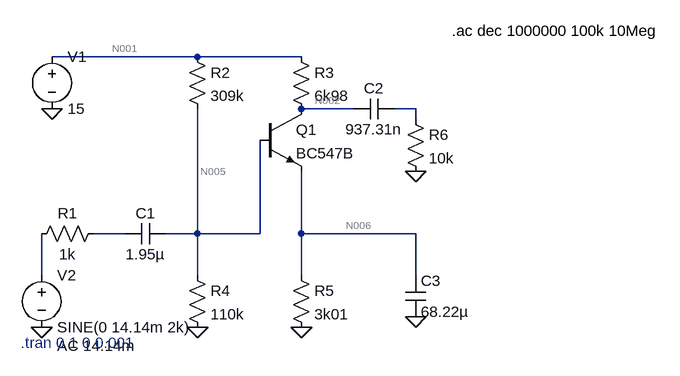
[diagram p0: schematic kursusgang 9.asc]
kursusgang 9.asc, the LTspice schematic file:
Version 4
SHEET 1 972 680
WIRE 224 96 0 96
WIRE 384 96 224 96
WIRE 464 176 384 176
WIRE 560 176 528 176
WIRE 560 192 560 176
WIRE 112 368 64 368
WIRE 224 368 224 176
WIRE 224 368 176 368
WIRE 320 368 320 224
WIRE 320 368 224 368
WIRE 384 368 384 272
WIRE 560 368 384 368
WIRE -16 432 -16 368
WIRE 224 432 224 368
WIRE 384 432 384 368
WIRE 560 432 560 368
FLAG 560 272 0
FLAG 384 512 0
FLAG 224 512 0
FLAG -16 512 0
FLAG 560 496 0
FLAG 0 176 0
SYMBOL voltage 0 80 R0
WINDOW 123 0 0 Left 0
WINDOW 39 0 0 Left 0
SYMATTR InstName V1
SYMATTR Value 15
SYMBOL voltage -16 416 R0
WINDOW 123 24 124 Left 2
WINDOW 39 0 0 Left 0
SYMATTR InstName V2
SYMATTR Value SINE(0 14.14m 2k)
SYMATTR Value2 AC 14.14m
SYMBOL res 80 352 R90
WINDOW 0 0 56 VBottom 2
WINDOW 3 32 56 VTop 2
SYMATTR InstName R1
SYMATTR Value 1k
SYMBOL res 208 80 R0
SYMATTR InstName R2
SYMATTR Value 309k
SYMBOL res 368 80 R0
SYMATTR InstName R3
SYMATTR Value 6k98
SYMBOL res 208 416 R0
SYMATTR InstName R4
SYMATTR Value 110k
SYMBOL cap 176 352 R90
WINDOW 0 0 32 VBottom 2
WINDOW 3 32 32 VTop 2
SYMATTR InstName C1
SYMATTR Value 1.95µ
SYMBOL npn 320 176 R0
SYMATTR InstName Q1
SYMATTR Value BC547B
SYMBOL res 368 416 R0
SYMATTR InstName R5
SYMATTR Value 3k01
SYMBOL cap 528 160 R90
WINDOW 0 0 32 VBottom 2
WINDOW 3 32 32 VTop 2
SYMATTR InstName C2
SYMATTR Value 937.31n
SYMBOL res 544 176 R0
SYMATTR InstName R6
SYMATTR Value 10k
SYMBOL cap 544 432 R0
SYMATTR InstName C3
SYMATTR Value 68.22µ
TEXT -48 536 Left 2 ;.tran 0 1 0 0.001
TEXT 616 56 Left 2 !.ac dec 1000000 100k 10Meg

The netlist it stands for:
* kursusgang 9.asc
V1 N001 0 15
V2 N007 0 SINE(0 14.14m 2k) AC 14.14m
R1 N004 N007 1k
R2 N001 N005 309k
R3 N001 N002 6k98
R4 N005 0 110k
C1 N005 N004 1.95µ
Q1 N002 N005 N006 0 BC547B
R5 N006 0 3k01
C2 N003 N002 937.31n
R6 N003 0 10k
C3 N006 0 68.22µ
.model NPN NPN
.model PNP PNP
.lib standard.bjt
* .tran 0 1 0 0.001
.ac dec 1000000 100k 10Meg
.backanno
.end

* Results of the author's LTspice run, read from the files saved beside the schematic
* Operating Point, zero values left out:
*   V(n001) = 15 V
*   V(n005) = 3.669 V
*   V(n002) = 7.994 V
*   V(n006) = 3.031 V
*   Ic(Q1) = 1.004 mA
*   Ib(Q1) = 3.321 µA
*   Ie(Q1) = -1.007 mA
*   I(R2) = 36.67 µA
*   I(R3) = 1.004 mA
*   I(R4) = 33.35 µA
*   I(R5) = 1.007 mA
*   I(V1) = -1.04 mA